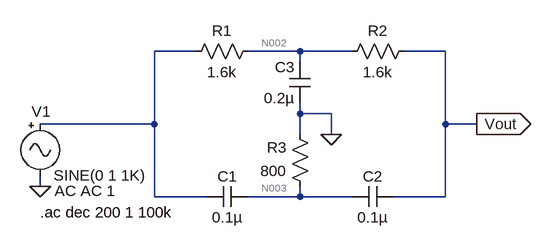
[diagram p0: schematic Passive Twin-T.asc]
Passive Twin-T.asc, the LTspice schematic file:
Version 4
SHEET 1 880 680
WIRE 80 160 16 160
WIRE 240 160 160 160
WIRE 320 160 240 160
WIRE 464 160 400 160
WIRE 240 176 240 160
WIRE 240 256 240 240
WIRE 288 256 240 256
WIRE 16 272 16 160
WIRE 16 272 -160 272
WIRE 464 272 464 160
WIRE 512 272 464 272
WIRE 240 288 240 256
WIRE 288 288 288 256
WIRE -160 368 -160 352
WIRE 16 384 16 272
WIRE 96 384 16 384
WIRE 240 384 240 368
WIRE 240 384 160 384
WIRE 320 384 240 384
WIRE 464 384 464 272
WIRE 464 384 384 384
FLAG 288 288 0
FLAG -160 368 0
FLAG 512 272 Vout
IOPIN 512 272 Out
SYMBOL res 176 144 R90
WINDOW 0 0 56 VBottom 2
WINDOW 3 32 56 VTop 2
SYMATTR InstName R1
SYMATTR Value 1.6k
SYMBOL res 416 144 R90
WINDOW 0 0 56 VBottom 2
WINDOW 3 32 56 VTop 2
SYMATTR InstName R2
SYMATTR Value 1.6k
SYMBOL res 256 384 R180
WINDOW 0 36 76 Left 2
WINDOW 3 36 40 Left 2
SYMATTR InstName R3
SYMATTR Value 800
SYMBOL cap 160 368 R90
WINDOW 0 0 32 VBottom 2
WINDOW 3 32 32 VTop 2
SYMATTR InstName C1
SYMATTR Value 0.1µ
SYMBOL cap 384 368 R90
WINDOW 0 0 32 VBottom 2
WINDOW 3 32 32 VTop 2
SYMATTR InstName C2
SYMATTR Value 0.1µ
SYMBOL cap 256 240 R180
WINDOW 0 24 56 Left 2
WINDOW 3 24 8 Left 2
SYMATTR InstName C3
SYMATTR Value 0.2µ
SYMBOL Misc\\signal -160 256 R0
WINDOW 0 -13 -3 Left 2
WINDOW 3 21 95 Left 2
WINDOW 123 22 119 Left 2
WINDOW 39 0 0 Left 0
SYMATTR InstName V1
SYMATTR Value2 AC AC 1
TEXT -160 408 Left 2 !.ac dec 200 1 100k

The netlist it stands for:
* Passive Twin-T.asc
R1 N002 N001 1.6k
R2 Vout N002 1.6k
R3 N003 0 800
C1 N003 N001 0.1µ
C2 Vout N003 0.1µ
C3 0 N002 0.2µ
V1 N001 0 SINE(0 1 1K) AC AC 1
.ac dec 200 1 100k
.backanno
.end

* Results of the author's LTspice run, read from the files saved beside the schematic
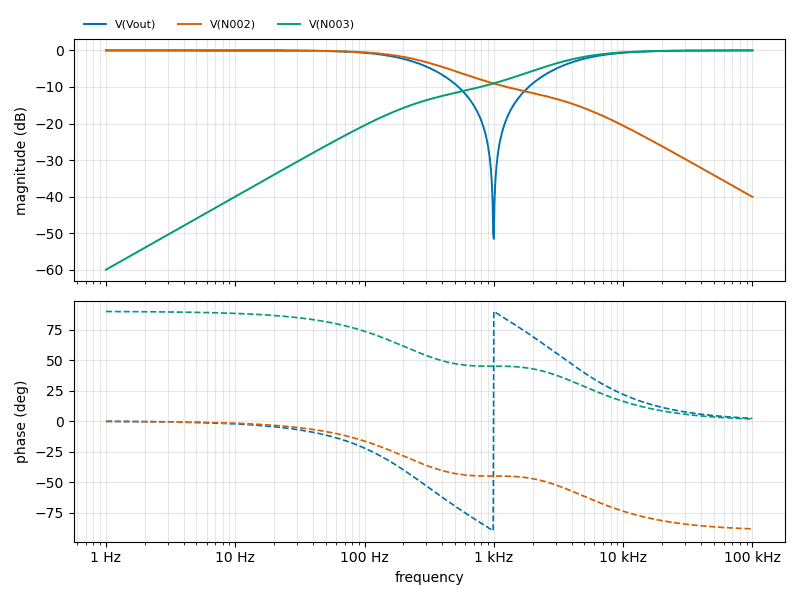
[diagram p1: AC Analysis of Passive Twin-T.asc, plotted from the saved traces]
* AC Analysis, 1 run:
*   V(Vout): -0.00 dB at 1 Hz, -0.01 dB at 100 kHz, peak -0.00 dB at 1 Hz, 3 dB below the peak at 234.8 Hz
*   V(N002): -0.00 dB at 1 Hz, -40.05 dB at 100 kHz, peak -0.00 dB at 1 Hz, 3 dB below the peak at 286.2 Hz
*   V(N003): -59.95 dB at 1 Hz, -0.01 dB at 100 kHz, peak -0.01 dB at 100 kHz, 3 dB below the peak at 3.453 kHz